# Altium schematic sheet Shield_MMA8452_rouge.SchDoc: Shield MMA8452 rouge
size A4; Date: 13/01/2017; CheckedBy: Nicolas LAW; Author: Nicolas LAW; DrawnBy: Nicolas LAW; Engineer: Nicolas LAW; Revision: 1; SheetNumber: 1; SheetTotal: 1; DocumentName: Shield MMA8452 rouge; ProjectName: Knocklet
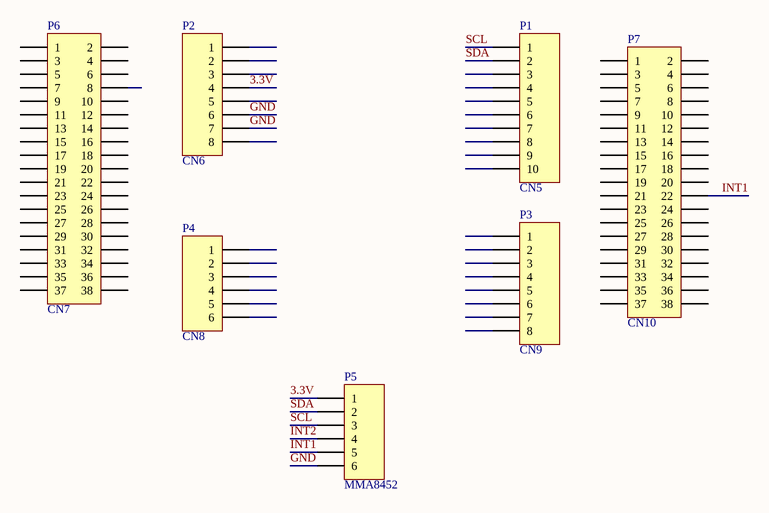
[diagram p0: Shield_MMA8452_rouge.SchDoc]

## Parts
P1  CN5  [HDR1X10]
P2  CN6  [HDR1X8]
P3  CN9  [HDR1X8]
P4  CN8  [HDR1X6]
P5  MMA8452  [HDR1X6]
P6  CN7  [HDR2X19]
P7  CN10  [HDR2X19]

## Nets
3.3V: P2.4 P5.1
GND: P2.6 P2.7 P5.6
INT1: P5.5 P7.22
INT2: P5.4
SCL: P1.1 P5.3
SDA: P1.2 P5.2

Not connected (* = marked no-connect by the designer): P1 3 4 5 6 7 8 9 10; P2 1 2 3 5 8; P3 1 2 3 4 5 6 7 8; P4 1 2 3 4 5 6; P6 1 2 3 4 5 6 7 8 9 10 11 12 13 14 15 16 17 18 19 20 21 22 23 24 25 26 27 28 29 30 31 32 33 34 35 36 37 38; P7 1 2 3 4 5 6 7 8 9 10 11 12 13 14 15 16 17 18 19 20 21 23 24 25 26 27 28 29 30 31 32 33 34 35 36 37 38

## Notes on the sheet
- Title
- Size:
- Date:
- A4
- Number:
- Time:
- Revision:
- Sheet
- of
- File:

## Library data of the parts
P1 = Header 10: Header, 10-Pin; LatestRevisionDate: 17-Jul-2002; LatestRevisionNote: Re-released for DXP Platform.; Publisher: Altium Limited
P2 P3 = Header 8: Header, 8-Pin; LatestRevisionDate: 17-Jul-2002; LatestRevisionNote: Re-released for DXP Platform.; Publisher: Altium Limited
P4 P5 = Header 6: Header, 6-Pin; LatestRevisionDate: 17-Jul-2002; LatestRevisionNote: Re-released for DXP Platform.; Publisher: Altium Limited
P6 P7 = Header 19X2: Header, 19-Pin, Dual row; LatestRevisionDate: 17-Jul-2002; LatestRevisionNote: Re-released for DXP Platform.; Publisher: Altium Limited